# EAGLE design M785-3116 (EAGLE 6.6.0)
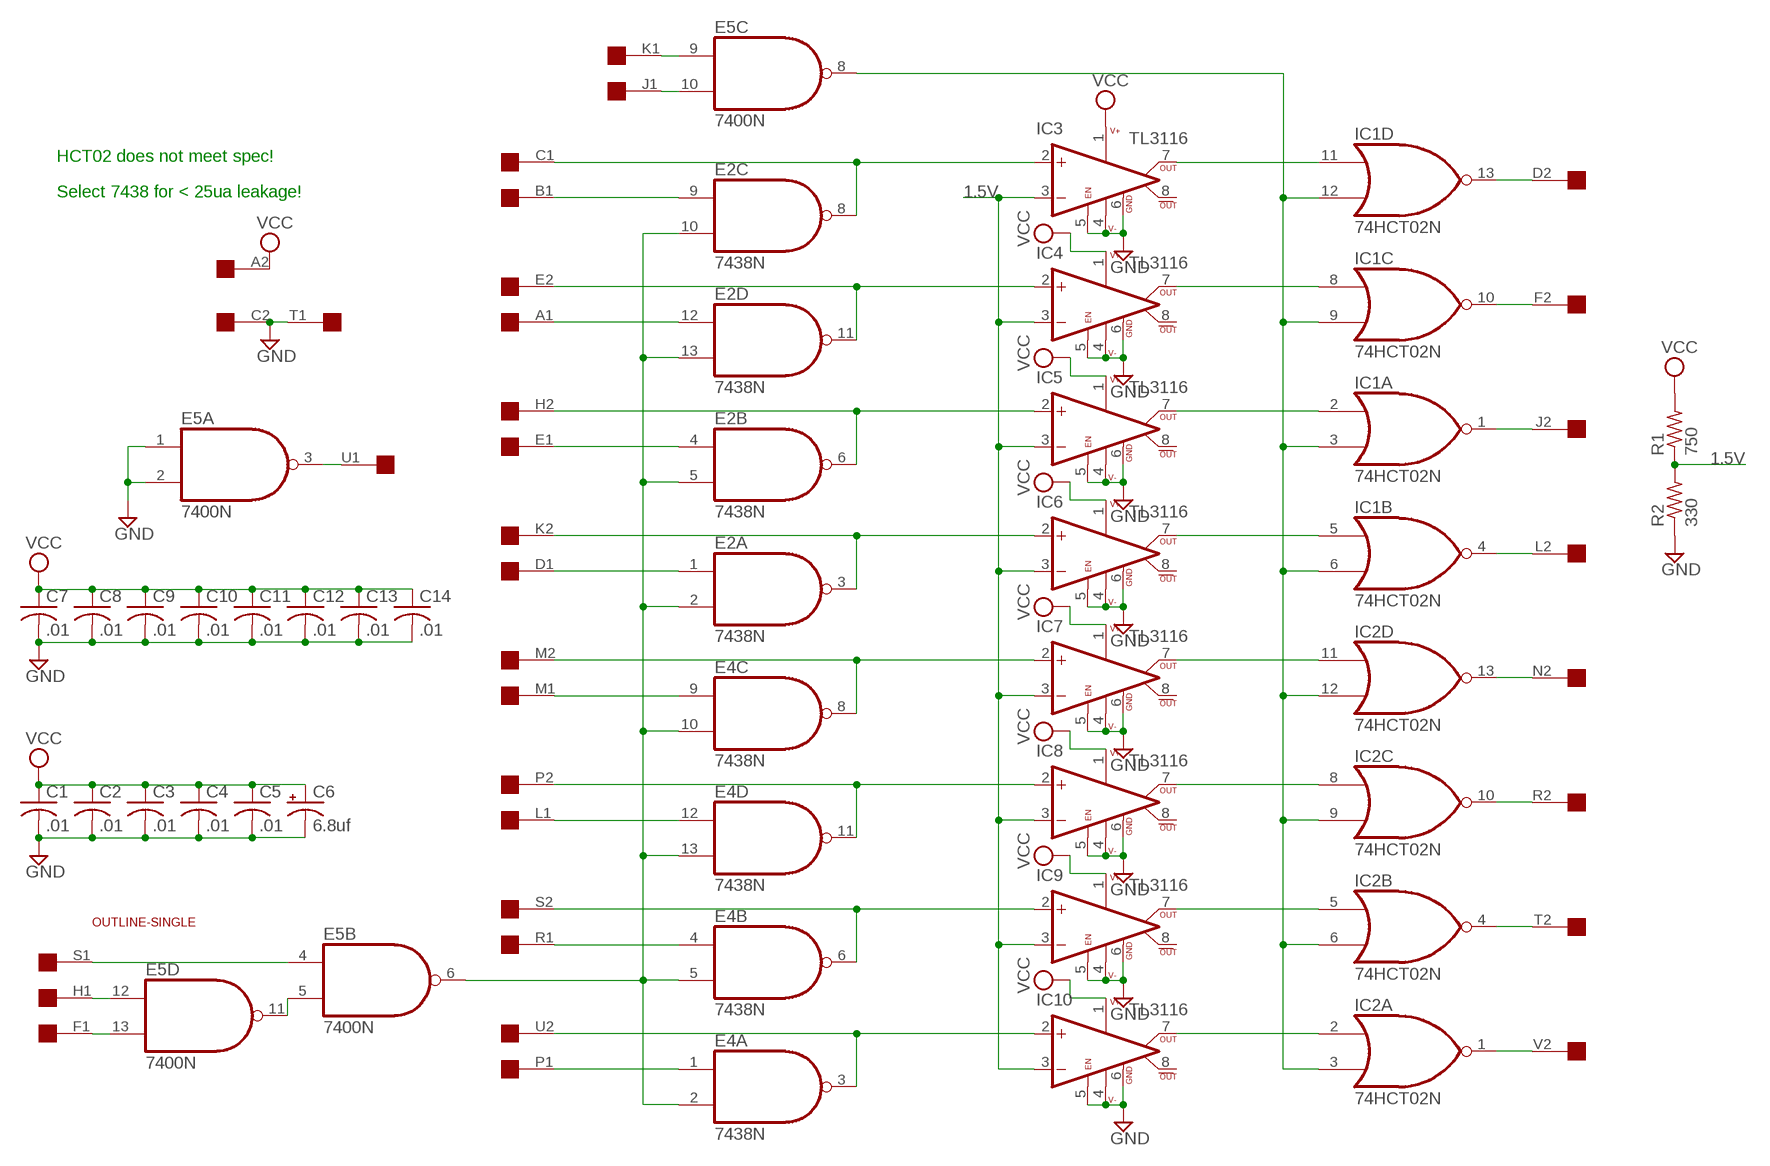
[diagram p0: schematic, sheet 1]

## Parts
C1  .01  C-US050-025X075  [C050-025X075]
C2  .01  C-US050-025X075  [C050-025X075]
C3  .01  C-US050-025X075  [C050-025X075]
C4  .01  C-US050-025X075  [C050-025X075]
C5  .01  C-US050-025X075  [C050-025X075]
C6  6.8uf  CPOL-USE15-5AXIAL  [E15-5]
C7  .01  C-US050-025X075  [C050-025X075]
C8  .01  C-US050-025X075  [C050-025X075]
C9  .01  C-US050-025X075  [C050-025X075]
C10  .01  C-US050-025X075  [C050-025X075]
C11  .01  C-US050-025X075  [C050-025X075]
C12  .01  C-US050-025X075  [C050-025X075]
C13  .01  C-US050-025X075  [C050-025X075]
C14  .01  C-US050-025X075  [C050-025X075]
E2  7438N  [DIL14]
E4  7438N  [DIL14]
E5  7400N  [DIL14]
IC1  74HCT02N  7402N  [DIL14]
IC2  74HCT02N  7402N  [DIL14]
IC3  TL3116  LT1016CN  [DIL08]
IC4  TL3116  LT1016CN  [DIL08]
IC5  TL3116  LT1016CN  [DIL08]
IC6  TL3116  LT1016CN  [DIL08]
IC7  TL3116  LT1016CN  [DIL08]
IC8  TL3116  LT1016CN  [DIL08]
IC9  TL3116  LT1016CN  [DIL08]
IC10  TL3116  LT1016CN  [DIL08]
R1  750  R-US_0207/10  [0207/10]
R2  330  R-US_0207/10  [0207/10]
U$1  SINGLE  [EDGE-CON2]
U$2  OUTLINE-SINGLE  [SINGLE]

## Nets
1.5V: IC3.3(-IN) IC4.3(-IN) IC5.3(-IN) IC6.3(-IN) IC7.3(-IN) IC8.3(-IN) IC9.3(-IN) IC10.3(-IN) R1.1 R2.2
GND: C1.2 C2.2 C3.2 C4.2 C5.2 C6.- C7.2 C8.2 C9.2 C10.2 C11.2 C12.2 C13.2 C14.2 E5.1(A:I0) E5.2(A:I1) IC3.4(V-) IC3.5(LA_EN) IC3.6(GND) IC4.4(V-) IC4.5(LA_EN) IC4.6(GND) IC5.4(V-) IC5.5(LA_EN) IC5.6(GND) IC6.4(V-) IC6.5(LA_EN) IC6.6(GND) IC7.4(V-) IC7.5(LA_EN) IC7.6(GND) IC8.4(V-) IC8.5(LA_EN) IC8.6(GND) IC9.4(V-) IC9.5(LA_EN) IC9.6(GND) IC10.4(V-) IC10.5(LA_EN) IC10.6(GND) R2.1 U$1.C2 U$1.T1
N$1: E5.8(C:O) IC1.3(A:I1) IC1.6(B:I1) IC1.9(C:I1) IC1.12(D:I1) IC2.3(A:I1) IC2.6(B:I1) IC2.9(C:I1) IC2.12(D:I1)
N$2: E2.2(A:I1) E2.5(B:I1) E2.10(C:I1) E2.13(D:I1) E4.2(A:I1) E4.5(B:I1) E4.10(C:I1) E4.13(D:I1) E5.6(B:O)
N$3: E4.8(C:O) IC7.2(+IN) U$1.M2
N$4: E4.3(A:O) IC10.2(+IN) U$1.U2
N$5: E4.1(A:I0) U$1.P1
N$6: E4.4(B:I0) U$1.R1
N$7: E4.6(B:O) IC9.2(+IN) U$1.S2
N$8: E4.12(D:I0) U$1.L1
N$9: E4.11(D:O) IC8.2(+IN) U$1.P2
N$10: E4.9(C:I0) U$1.M1
N$11: E2.8(C:O) IC3.2(+IN) U$1.C1
N$12: E2.9(C:I0) U$1.B1
N$13: E2.11(D:O) IC4.2(+IN) U$1.E2
N$14: E2.12(D:I0) U$1.A1
N$15: E2.6(B:O) IC5.2(+IN) U$1.H2
N$16: E2.4(B:I0) U$1.E1
N$17: E2.3(A:O) IC6.2(+IN) U$1.K2
N$18: E2.1(A:I0) U$1.D1
N$19: E5.9(C:I0) U$1.K1
N$20: E5.10(C:I1) U$1.J1
N$21: IC1.13(D:O) U$1.D2
N$22: IC1.10(C:O) U$1.F2
N$23: IC1.1(A:O) U$1.J2
N$24: IC1.4(B:O) U$1.L2
N$25: IC2.13(D:O) U$1.N2
N$26: IC2.10(C:O) U$1.R2
N$27: IC2.4(B:O) U$1.T2
N$28: IC2.1(A:O) U$1.V2
N$29: E5.4(B:I0) U$1.S1
N$30: E5.5(B:I1) E5.11(D:O)
N$31: E5.12(D:I0) U$1.H1
N$32: E5.13(D:I1) U$1.F1
N$33: E5.3(A:O) U$1.U1
N$34: IC1.11(D:I0) IC3.7(OUT)
N$35: IC2.11(D:I0) IC7.7(OUT)
N$36: IC1.5(B:I0) IC6.7(OUT)
N$37: IC1.2(A:I0) IC5.7(OUT)
N$38: IC1.8(C:I0) IC4.7(OUT)
N$39: IC2.5(B:I0) IC9.7(OUT)
N$40: IC2.8(C:I0) IC8.7(OUT)
N$43: IC2.2(A:I0) IC10.7(OUT)
VCC: C1.1 C2.1 C3.1 C4.1 C5.1 C6.+ C7.1 C8.1 C9.1 C10.1 C11.1 C12.1 C13.1 C14.1 IC3.1(V+) IC4.1(V+) IC5.1(V+) IC6.1(V+) IC7.1(V+) IC8.1(V+) IC9.1(V+) IC10.1(V+) R1.2 U$1.A2
Unconnected: IC3.8(!OUT) IC4.8(!OUT) IC5.8(!OUT) IC6.8(!OUT) IC7.8(!OUT) IC8.8(!OUT) IC9.8(!OUT) IC10.8(!OUT) U$1.B2 U$1.N1 U$1.V1

## Notes on the sheet
- HCT02 does not meet spec!
- Select 7438 for < 25ua leakage!

## Power pins joined to a net without a drawn wire
GND: E2.7(P:GND) E4.7(P:GND) E5.7(P:GND) IC1.7(P:GND) IC2.7(P:GND)
VCC: E2.14(P:VCC) E4.14(P:VCC) E5.14(P:VCC) IC1.14(P:VCC) IC2.14(P:VCC)

## Library data of the parts
C1-C5 C7-C14 = rcl:C-US: CAPACITOR, American symbol
C6 = rcl:CPOL-US: POLARIZED CAPACITOR, American symbol
E2 E4 = dec-con:74*38: Quad 2-input NAND gate, open collector output
E5 = 74xx-us:74*00: Quad 2-input NAND gate
IC1 IC2 = 74xx-us:74*02: Quad 2-input NOR gate
IC3-IC10 = linear-technology:LT1016: Ultra-fast precision COMPARATOR; MPN: LT1016CN8; OC_FARNELL: 9559353; OC_NEWARK: 57M0852
R1 R2 = rcl:R-US_: RESISTOR, American symbol
U$1 = dec-con:SINGLE: Single-Height DEC board
U$2 = dec-con:OUTLINE-*: Board outlines for DEC boards.

## Board
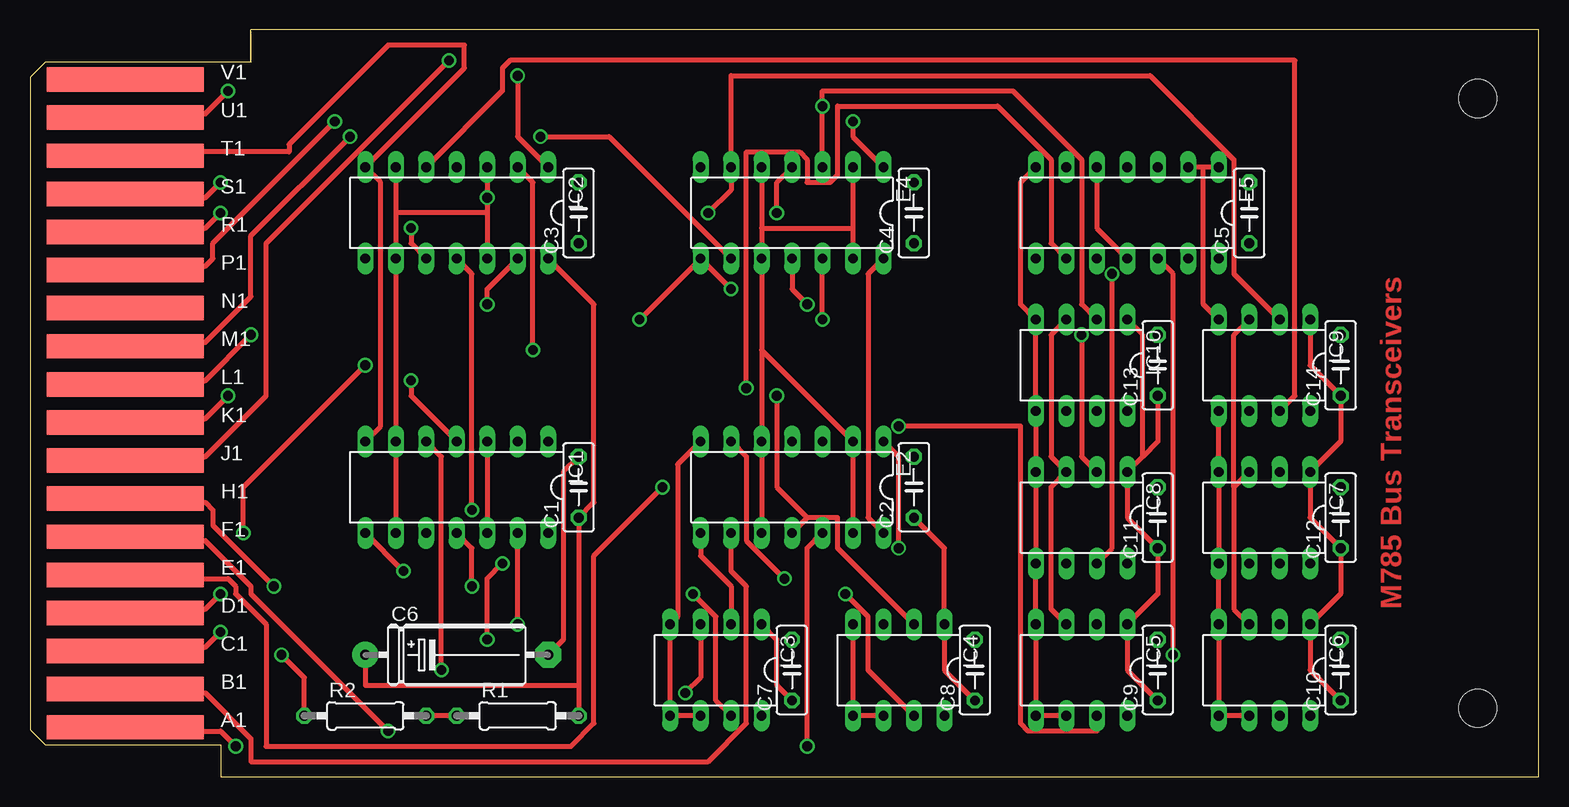
[diagram p1: board, top side]
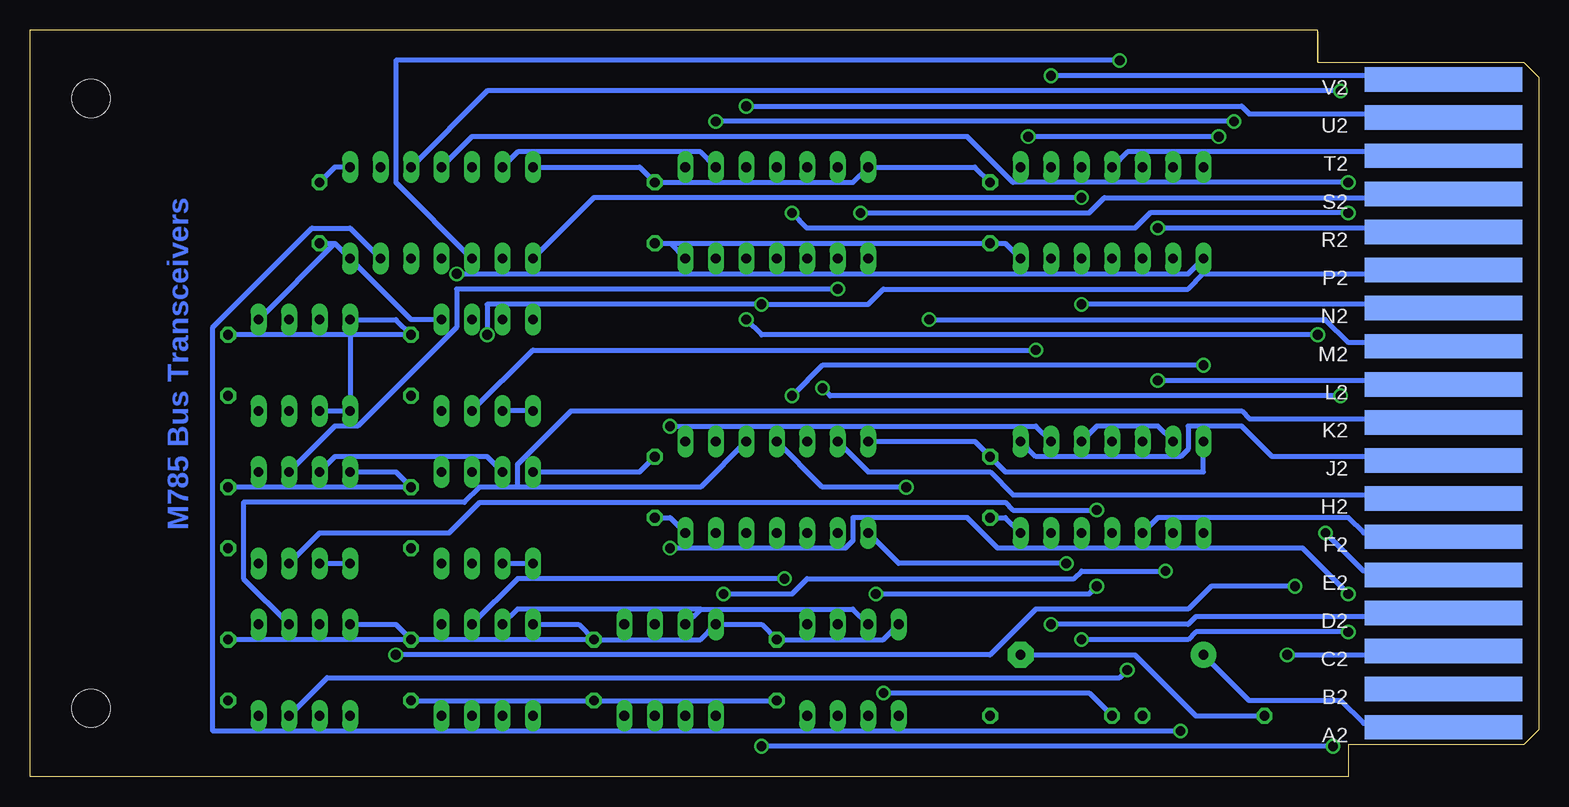
[diagram p2: board, bottom side, seen from below]

Size 125.73 x 62.23 mm. Coordinates in mm from the lower left corner, seen from the top.
Copper layers (1+16): Top 0.035mm / dielectric 1.5mm / Bottom 0.035mm
Design rules "16mils": minimum track width 16mil, minimum drill 32mil, track to track 15mil, track to pad 10mil, pad to pad 10mil, via to via 10mil, smd to smd 10mil, copper to edge 13mil, drill to drill 10mil, minimum pad ring 10mil, minimum via ring 8mil, stop-mask expansion 0mil, vias tented up to drill 0mil, thermal gap 10mil

### Footprints (pad centres in the part's own frame; a part is rotated, then mirrored left to right if it is on the bottom)
C050-025X075 = drill 0.813 octagon: 1 -2.54,0; 2 2.54,0
E15-5 = drill 0.813 pad 2.159: + -7.62,0 | drill 0.813 pad 2.159 octagon: - 7.62,0
DIL14 = drill 0.813 long: 1 -7.62,-3.81; 2 -5.08,-3.81; 3 -2.54,-3.81; 4 0,-3.81; 5 2.54,-3.81; 6 5.08,-3.81; 7 7.62,-3.81; 8 7.62,3.81; 9 5.08,3.81; 10 2.54,3.81; 11 0,3.81; 12 -2.54,3.81; 13 -5.08,3.81; 14 -7.62,3.81
DIL08 = drill 0.813 long: 1 -3.81,-3.81; 2 -1.27,-3.81; 3 1.27,-3.81; 4 3.81,-3.81; 5 3.81,3.81; 6 1.27,3.81; 7 -1.27,3.81; 8 -3.81,3.81
0207/10 = drill 0.813 octagon: 1 -5.08,0; 2 5.08,0
EDGE-CON2 = smd 13.106 x 2.032: A1 7.938,4.128; B1 7.938,7.303; C1 7.938,10.477; D1 7.938,13.652; E1 7.938,16.828; F1 7.938,20.003; H1 7.938,23.177; J1 7.938,26.352; K1 7.938,29.527; L1 7.938,32.703; M1 7.938,35.877; N1 7.938,39.053; P1 7.938,42.227; R1 7.938,45.403; S1 7.938,48.578; T1 7.938,51.752; U1 7.938,54.928; V1 7.938,58.102 | smd 13.106 x 2.032 bottom: A2 7.938,4.128; B2 7.938,7.303; C2 7.938,10.477; D2 7.938,13.652; E2 7.938,16.828; F2 7.938,20.003; H2 7.938,23.177; J2 7.938,26.352; K2 7.938,29.527; L2 7.938,32.703; M2 7.938,35.877; N2 7.938,39.053; P2 7.938,42.227; R2 7.938,45.403; S2 7.938,48.578; T2 7.938,51.752; U2 7.938,54.928; V2 7.938,58.102
SINGLE = hole 3.175: 120.65,56.515; 120.65,5.715

### Placement (x,y rotation side)
C1  45.72,24.13 90 top
C2  73.66,24.13 90 top
C3  45.72,46.99 90 top
C4  73.66,46.99 90 top
C5  101.6,46.99 90 top
C6  35.56,10.16 0 top
C7  63.5,8.89 90 top
C8  78.74,8.89 90 top
C9  93.98,8.89 90 top
C10  109.22,8.89 90 top
C11  93.98,21.59 90 top
C12  109.22,21.59 90 top
C13  93.98,34.29 90 top
C14  109.22,34.29 90 top
E2  63.5,24.13 180 top
E4  63.5,46.99 180 top
E5  91.44,46.99 180 top
IC1  35.56,24.13 180 top
IC2  35.56,46.99 180 top
IC3  57.15,8.89 180 top
IC4  72.39,8.89 180 top
IC5  87.63,8.89 180 top
IC6  102.87,8.89 180 top
IC7  102.87,21.59 180 top
IC8  87.63,21.59 180 top
IC9  102.87,34.29 180 top
IC10  87.63,34.29 180 top
R1  40.64,5.08 0 top
R2  27.94,5.08 0 top
U$1  0,0 0 top
U$2  0,0 0 top

### Tracks (layer width: path | path; a pad name or v marks a point on that pad's centre or on a via)
1.5V  (via drill 0.81)
  Top 0.406: IC6.3 100.33,13.97 100.33,24.13 | IC7.3 100.33,24.13 | IC9.3 100.33,36.83 100.33,24.13 | IC10.3 85.09,36.83 85.09,26.67 IC8.3 85.09,24.13 85.09,13.97 IC5.3 | R1.1 R2.2 | v54.61,6.99 55.88,8.26 IC3.3
  Bottom 0.406: IC3.3 57.15,13.97 69.85,13.97 | IC4.3 69.85,13.97 | IC5.3 85.09,13.97 69.85,13.97 | R1.1 37.47,6.99 v54.61,6.99 | IC7.3 100.33,26.67 87.63,26.67 IC8.3
GND  (via drill 0.81)
  Top 0.406: IC6.6 IC6.5 IC6.4 IC7.5 IC7.4 IC9.5 | E5.1 97.79,50.8 | 97.79,50.8 E5.2 | 97.79,50.8 97.79,39.37 IC9.4 | IC3.6 IC3.5 IC3.4 53.98,13.34 53.98,26.04 E2.7 | IC4.6 IC4.5 IC4.4 | IC5.6 IC5.5 IC5.4 IC8.5 IC8.4 IC10.5 IC10.4 82.55,39.37 82.55,49.53 E5.7 | IC1.7 29.21,29.21 29.21,49.53 IC2.7 36.2,59.05 36.2,60.96 29.85,60.96 21.59,52.7 21.59,52.07 8.26,52.07 U$1.T1 | C6.- 44.45,11.43 44.45,25.4 C1.2 | v20.96,10.16 22.86,8.26 R2.1
  Bottom 0.406: IC7.6 IC7.5 | C9.2 95.25,12.7 IC6.4 | C9.2 C10.2 | IC9.6 IC9.5 99.06,36.83 | IC7.4 95.25,25.4 C11.2 C12.2 | C5.2 100.33,50.8 E5.1 | IC9.4 95.25,38.1 C13.2 99.06,36.83 | 99.06,36.83 C14.2 | C3.2 46.99,50.8 E4.7 57.15,49.53 C4.2 74.93,50.8 E5.7 | IC3.4 54.61,11.43 C7.2 64.77,12.7 IC4.4 69.85,11.43 C8.2 | IC8.6 IC8.5 | C8.2 80.01,12.7 IC5.4 | C2.2 74.93,25.4 IC8.4 | IC10.5 IC10.6 | C8.2 C9.2 | R2.1 28.58,5.08 33.66,10.16 C6.- | E2.7 46.99,27.94 C1.2 44.45,25.4 27.94,25.4 IC1.7 | v20.96,10.16 8.26,10.16 U$1.C2
N$1  (via drill 0.81)
  Top 0.406: IC1.3 IC1.12 | IC1.9 IC1.6 IC2.9 30.48,46.99 | IC2.6 30.48,46.99 | IC2.3 v38.1,48.26 38.1,46.99 | 38.1,46.99 IC2.12 | 38.1,46.99 30.48,46.99
  Bottom 0.406: IC1.3 36.83,29.21 31.75,29.21 IC1.6 | E5.8 78.74,48.26 v38.1,48.26
N$2
  Top 0.406: E4.2 68.58,45.72 | 68.58,45.72 E4.13 | E2.13 E2.2 60.96,35.56 | E2.10 E2.5 60.96,35.56 | E4.5 60.96,45.72 | 60.96,45.72 E4.10 60.96,35.56 | 60.96,45.72 68.58,45.72
  Bottom 0.406: E5.6 85.09,52.07 69.85,52.07 E4.2
N$3  (via drill 0.81)
  Top 0.406: v58.42,40.64 E4.8 v50.8,38.1
  Bottom 0.406: IC7.2 100.33,29.21 98.43,29.21 90.17,37.47 90.17,40.64 v58.42,40.64 | v50.8,38.1 17.78,38.1 15.88,36.2 8.26,36.2 U$1.M2
N$4  (via drill 0.81)
  Top 0.406: IC10.2 87.63,39.37 87.63,51.44 81.92,57.15 66.04,57.15 v66.04,55.88 E4.3
  Bottom 0.406: v66.04,55.88 24.77,55.88 24.13,55.24 8.26,55.24 U$1.U2
N$5  (via drill 0.81)
  Top 0.406: E4.1 68.58,53.34 v68.58,54.61 | v25.4,54.61 15.24,44.45 15.24,43.18 14.61,42.55 8.26,42.55 U$1.P1
  Bottom 0.406: v25.4,54.61 v68.58,54.61
N$6  (via drill 0.81)
  Top 0.406: E4.4 62.23,49.53 v62.23,46.99 | v15.88,46.99 14.61,45.72 8.26,45.72 U$1.R1
  Bottom 0.406: v62.23,46.99 60.96,45.72 33.66,45.72 32.39,46.99 v15.88,46.99
N$7  (via drill 0.81)
  Top 0.406: IC9.2 100.33,41.91 100.33,51.44 93.35,58.42 58.42,58.42 E4.6 58.42,48.9 v56.52,46.99
  Bottom 0.406: v56.52,46.99 37.47,46.99 36.2,48.26 8.26,48.26 U$1.S2
N$8  (via drill 0.81)
  Top 0.406: v66.04,38.1 E4.12 | v18.42,36.83 14.61,33.02 8.26,33.02 U$1.L1
  Bottom 0.406: v66.04,38.1 64.77,36.83 v18.42,36.83
N$9  (via drill 0.81)
  Top 0.406: IC8.2 87.63,26.67 v87.63,36.83 | v64.77,39.37 63.5,40.64 E4.11
  Bottom 0.406: v87.63,36.83 87.63,39.37 v64.77,39.37 55.88,39.37 54.61,40.64 29.21,40.64 27.94,41.91 8.26,41.91 U$1.P2
N$10  (via drill 0.81)
  Top 0.406: E4.9 48.26,53.34 v42.55,53.34 | v26.67,53.34 18.42,45.09 18.42,40.01 14.61,36.2 8.26,36.2 U$1.M1
  Bottom 0.406: v26.67,53.34 v42.55,53.34
N$11  (via drill 0.81)
  Top 0.406: IC3.2 58.42,15.88 55.88,18.41 E2.8 | v39.37,17.78 38.1,16.51 v38.1,11.43 | v15.88,12.06 14.61,10.79 8.26,10.79 U$1.C1
  Bottom 0.406: E2.8 53.34,17.78 v39.37,17.78 | v38.1,11.43 29.21,11.43 28.58,12.06 v15.88,12.06
N$12
  Top 0.406: E2.9 58.42,17.14 59.69,15.88 59.69,4.45 56.52,1.27 18.42,1.27 18.42,3.17 14.61,6.99 8.26,6.99 U$1.B1
N$13  (via drill 0.81)
  Top 0.406: 64.77,21.59 E2.11 | 64.77,21.59 67.31,21.59 67.31,19.05 IC4.2 | 64.77,21.59 62.23,24.13 v62.23,31.75 | v27.94,34.29 17.78,24.13 v17.78,20.32
  Bottom 0.406: v62.23,31.75 59.69,34.29 v27.94,34.29 | v17.78,20.32 14.61,17.14 8.26,17.14 U$1.E2
N$14  (via drill 0.81)
  Top 0.406: E2.12 64.77,19.05 v64.77,2.54 | v17.15,2.54 15.88,3.81 8.26,3.81 U$1.A1
  Bottom 0.406: v17.15,2.54 v64.77,2.54
N$15  (via drill 0.81)
  Top 0.406: v62.87,16.51 59.69,19.68 59.69,26.67 E2.6
  Bottom 0.406: IC5.2 85.09,16.51 v62.87,16.51 | E2.6 55.88,25.4 45.72,25.4 43.82,23.5 8.26,23.5 U$1.H2
N$16  (via drill 0.81)
  Top 0.406: v52.71,24.13 46.99,18.41 46.99,4.45 45.09,2.54 19.69,2.54 19.69,12.7 17.15,15.24 17.15,15.88 16.51,16.51 8.26,16.51 U$1.E1
  Bottom 0.406: E2.4 59.69,24.13 v52.71,24.13
N$17
  Bottom 0.406: IC6.2 107.95,16.51 107.95,22.86 89.54,22.86 88.27,24.13 85.09,24.13 | 85.09,24.13 69.85,24.13 E2.3 | 85.09,24.13 85.09,26.04 80.65,30.48 24.77,30.48 24.13,29.84 8.26,29.84 U$1.K2
N$18  (via drill 0.81)
  Top 0.406: E2.1 72.39,26.67 v72.39,19.05 | v15.88,15.24 14.61,13.97 8.26,13.97 U$1.D1
  Bottom 0.406: v72.39,19.05 57.79,19.05 57.15,19.68 57.15,21.59 47.63,21.59 45.09,19.05 19.69,19.05 v15.88,15.24
N$19  (via drill 0.81)
  Top 0.406: E5.9 85.09,44.45 85.09,51.44 80.65,55.88 67.31,55.88 67.31,50.16 66.68,49.53 64.77,49.53 64.77,51.44 64.14,52.07 59.69,52.07 v59.69,32.38 | v16.51,31.75 14.61,29.84 8.26,29.84 U$1.K1
  Bottom 0.406: v59.69,32.38 59.06,31.75 v16.51,31.75
N$20  (via drill 0.81)
  Top 0.406: v34.93,59.69 19.69,44.45 19.69,31.75 14.61,26.67 8.26,26.67 U$1.J1
  Bottom 0.406: E5.10 95.25,49.53 95.25,59.69 v34.93,59.69
N$21  (via drill 0.81)
  Top 0.406: v40.64,12.7 IC1.13
  Bottom 0.406: v40.64,12.7 29.21,12.7 28.58,13.34 8.26,13.34 U$1.D2
N$22
  Bottom 0.406: IC1.10 31.75,21.59 15.88,21.59 14.61,20.32 8.26,20.32 U$1.F2
N$23
  Bottom 0.406: IC1.1 41.91,26.67 29.85,26.67 29.21,27.3 29.21,29.21 24.77,29.21 22.23,26.67 8.26,26.67 U$1.J2
N$24  (via drill 0.81)
  Top 0.406: IC1.4 31.75,31.75 v31.75,33.02
  Bottom 0.406: v31.75,33.02 8.26,33.02 U$1.L2
N$25  (via drill 0.81)
  Top 0.406: IC2.13 38.1,40.64 v38.1,39.37
  Bottom 0.406: v38.1,39.37 8.26,39.37 U$1.N2
N$26  (via drill 0.81)
  Top 0.406: IC2.10 31.75,44.45 v31.75,45.72
  Bottom 0.406: v31.75,45.72 8.26,45.72 U$1.R2
N$27
  Bottom 0.406: IC2.4 34.29,52.07 8.26,52.07 U$1.T2
N$28  (via drill 0.81)
  Top 0.406: IC2.1 40.64,53.34 v40.64,58.42
  Bottom 0.406: v40.64,58.42 8.26,58.42 U$1.V2
N$29  (via drill 0.81)
  Top 0.406: v15.88,49.53 14.61,48.26 8.26,48.26 U$1.S1
  Bottom 0.406: E5.4 88.9,53.34 47.63,53.34 43.82,49.53 v15.88,49.53
N$30
  Top 0.406: E5.11 88.9,45.72 E5.5
N$31  (via drill 0.81)
  Top 0.406: E5.12 95.25,41.91 v95.25,10.16 | v20.32,15.88 15.24,20.95 15.24,22.23 14.61,22.86 8.26,22.86 U$1.H1
  Bottom 0.406: v95.25,10.16 45.72,10.16 41.91,13.97 29.21,13.97 27.31,15.88 v20.32,15.88
N$32  (via drill 0.81)
  Top 0.406: v29.85,3.81 18.42,15.24 18.42,15.88 14.61,19.68 8.26,19.68 U$1.F1
  Bottom 0.406: E5.13 99.06,45.72 102.24,45.72 110.49,37.47 110.49,3.81 v29.85,3.81
N$33  (via drill 0.81)
  Top 0.406: v16.51,57.15 14.61,55.24 8.26,55.24 U$1.U1
  Bottom 0.406: E5.3 87.63,57.15 v16.51,57.15
N$34  (via drill 0.81)
  Top 0.406: IC1.11 36.83,19.05 v36.83,15.88 | v55.25,15.24 57.15,13.34 57.15,6.35 IC3.7
  Bottom 0.406: v36.83,15.88 37.47,15.24 v55.25,15.24
N$35  (via drill 0.81)
  Top 0.406: IC2.11 36.83,41.91 v36.83,22.23
  Bottom 0.406: v36.83,22.23 43.82,22.23 44.45,22.86 88.27,22.86 90.81,20.32 101.6,20.32 IC7.7
N$36  (via drill 0.81)
  Top 0.406: IC1.5 34.29,26.67 v34.29,8.89
  Bottom 0.406: v34.29,8.89 34.93,8.26 100.97,8.26 IC6.7
N$37  (via drill 0.81)
  Top 0.406: v72.39,29.21 82.55,29.21 82.55,4.45 83.19,3.81 88.9,3.81 IC5.7
  Bottom 0.406: IC1.2 41.91,29.21 v72.39,29.21
N$38  (via drill 0.81)
  Top 0.406: v31.12,17.14 IC1.8 | v67.95,15.24 69.85,13.34 69.85,8.89 IC4.7
  Bottom 0.406: v31.12,17.14 38.1,17.14 38.74,16.51 60.96,16.51 62.23,15.24 v67.95,15.24
N$39
  Top 0.406: IC2.5 39.37,57.15 39.37,59.05 40.01,59.69 105.41,59.69 105.41,31.75 IC9.7
N$40  (via drill 0.81)
  Top 0.406: v90.17,41.91 90.17,19.05 IC8.7
  Bottom 0.406: IC2.8 29.21,41.91 v90.17,41.91
N$43  (via drill 0.81)
  Top 0.406: IC2.2 41.91,49.53 v41.91,35.56
  Bottom 0.406: v41.91,35.56 83.82,35.56 IC10.7
VCC
  Top 0.406: C10.1 106.68,8.89 IC6.1 109.22,15.24 C12.1 106.68,21.59 IC7.1 109.22,27.94 C14.1 106.68,34.29 IC9.1 | IC3.1 62.23,11.43 62.23,7.62 C7.1 | C8.1 76.2,8.89 IC4.1 76.2,19.05 C2.1 | C9.1 91.44,8.89 IC5.1 93.98,15.24 C11.1 91.44,21.59 IC8.1 92.71,26.67 | 92.71,26.67 93.98,27.94 C13.1 | IC10.1 92.71,36.83 92.71,26.67 | 45.72,7.62 C1.1 46.99,22.86 46.99,39.37 IC2.14 | 45.72,7.62 R1.2 | 45.72,7.62 27.94,7.62 C6.+ | E2.14 69.85,21.59 69.85,41.91 E4.14
  Bottom 0.406: 100.33,44.45 E5.14 93.98,38.1 IC10.1 | C5.1 100.33,44.45 | 100.33,44.45 IC9.1 | E2.14 72.39,21.59 C2.1 | C7.1 C8.1 C9.1 | IC2.14 44.45,44.45 C3.1 72.39,44.45 | 72.39,44.45 E4.14 | C4.1 72.39,44.45 | IC1.14 44.45,21.59 C1.1 | C6.+ 24.13,6.35 16.51,6.35 14.61,4.45 8.26,4.45 U$1.A2

### Text on the board
Top: M785 Bus Transceivers
Bottom: M785 Bus Transceivers